# Altium project Buck_24_to_5_Eval.PrjPcb
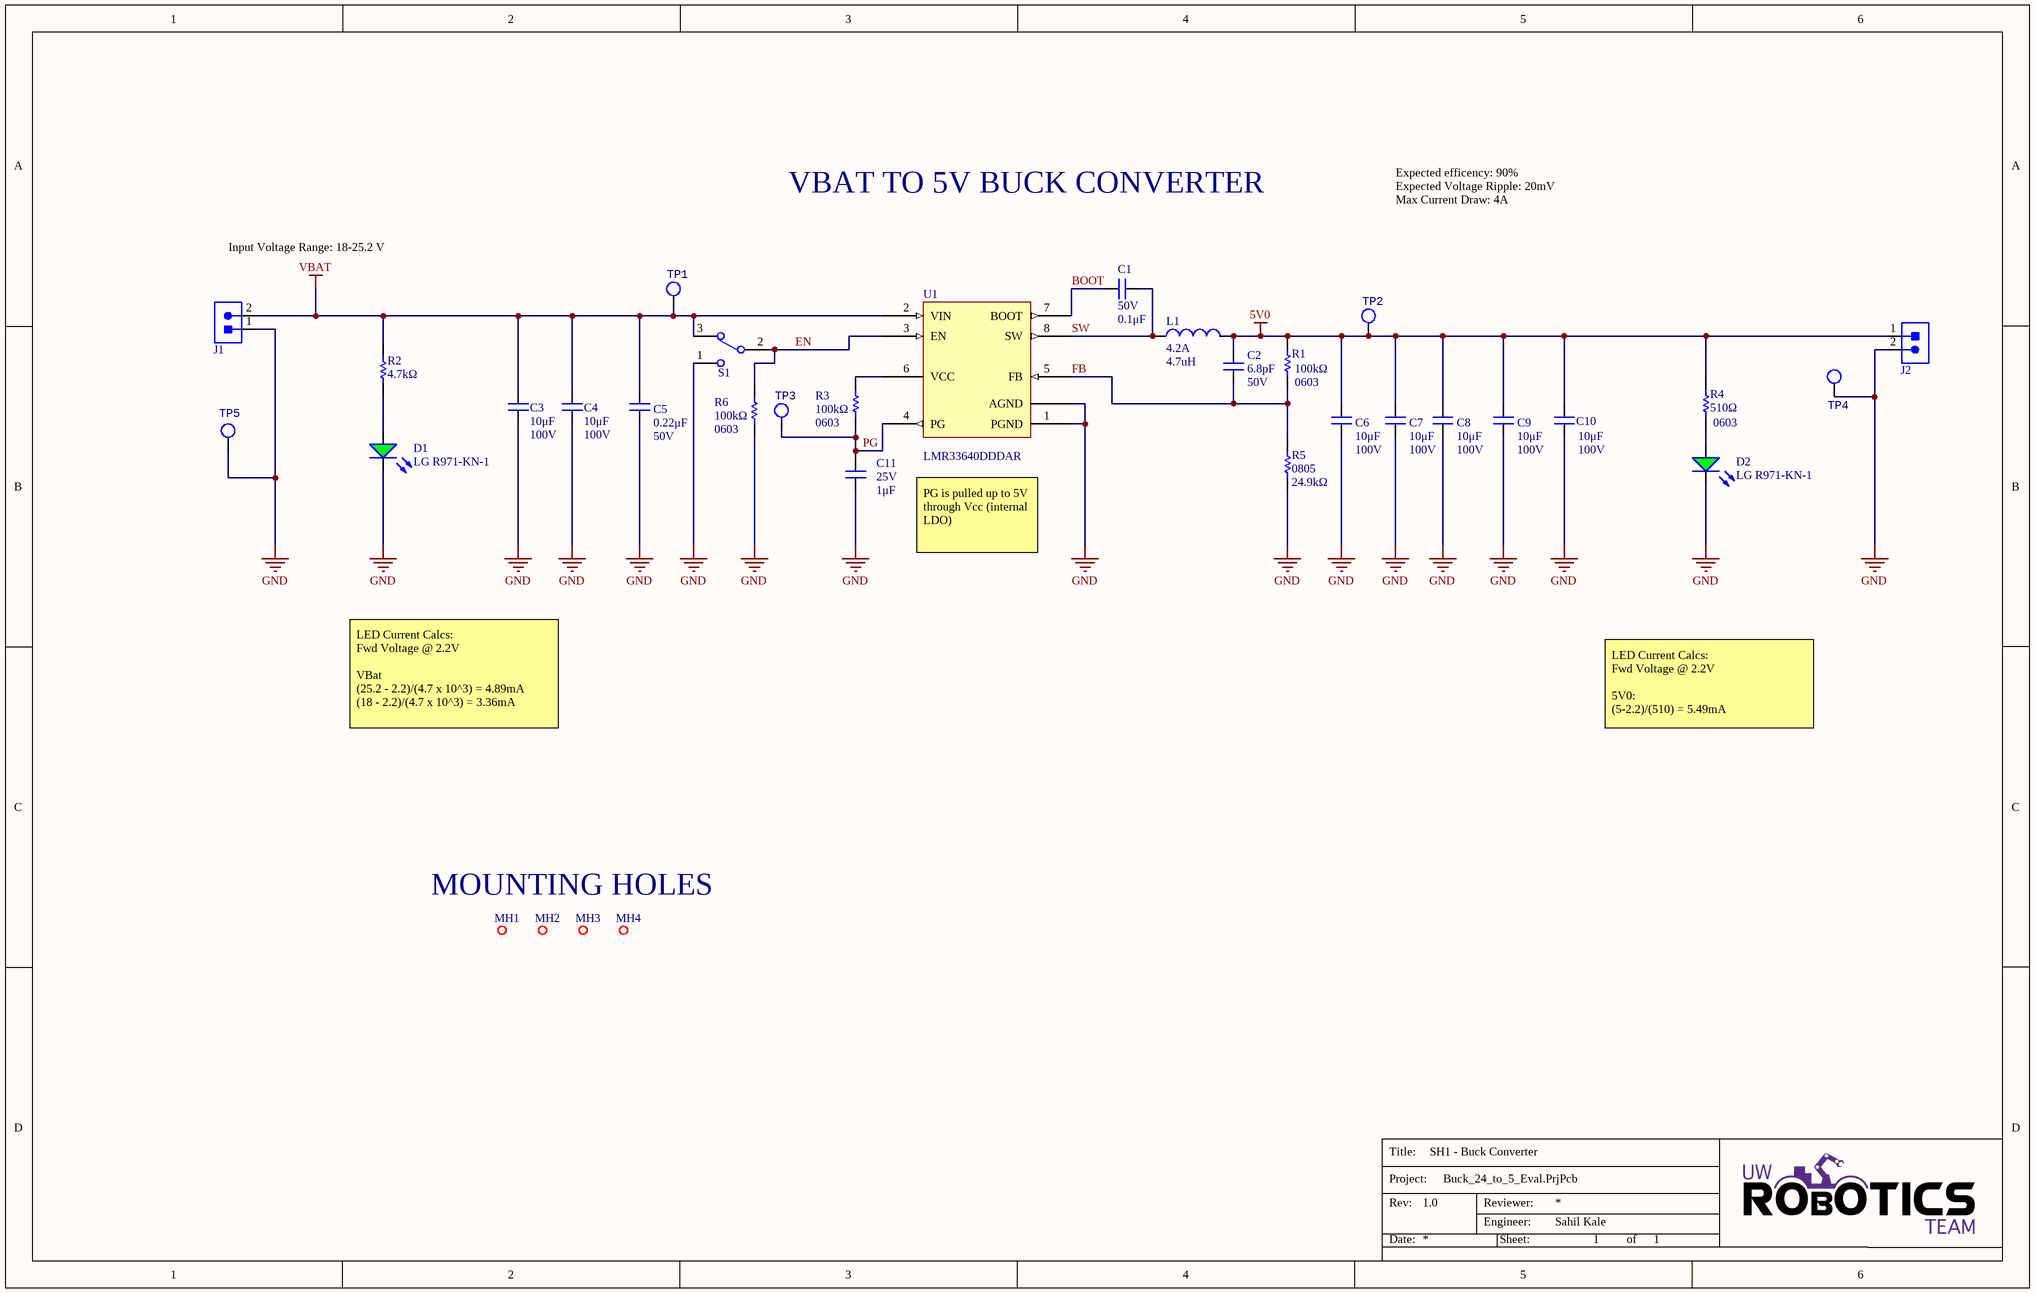
[diagram p0: SH1 - Buck Converter.SchDoc]
1 sheet, 33 parts. Net scope: global (net labels, ports and power ports of the same name join across sheets).
Board file: Buck_Eval_Board.PcbDoc

## Sheet SH1 - Buck Converter.SchDoc: SH1 - Buck Converter
size B; Date: 3/9/2021; Author: Sahil Kale; Engineer: Sahil Kale; Revision: 1.0; SheetNumber: 1; SheetTotal: 1; Time: 00:11

### Parts
C1  value 0.1μF  Voltage Rating: 50V  [CAP0603]  (hidden comment: CAP_0.1uF_50V_0603)
C2  value 6.8pF  Voltage Rating: 50V  [CAP0603]  (hidden comment: CAP_6.8pF_50V_0603)
C3  value 10μF  Voltage Rating: 100V  [CAP1210]  (hidden comment: CAP_10uF_100V_1210)
C4  value 10μF  Voltage Rating: 100V  [CAP1210]  (hidden comment: CAP_10uF_100V_1210)
C5  value 0.22μF  Voltage Rating: 50V  [CAP2012]  (hidden comment: CAP_0.22uF_50V_0805)
C6  value 10μF  Voltage Rating: 100V  [CAP1210]  (hidden comment: CAP_10uF_100V_1210)
C7  value 10μF  Voltage Rating: 100V  [CAP1210]  (hidden comment: CAP_10uF_100V_1210)
C8  value 10μF  Voltage Rating: 100V  [CAP1210]  (hidden comment: CAP_10uF_100V_1210)
C9  value 10μF  Voltage Rating: 100V  [CAP1210]  (hidden comment: CAP_10uF_100V_1210)
C10  value 10μF  Voltage Rating: 100V  [CAP1210]  (hidden comment: CAP_10uF_100V_1210)
C11  value 1μF  Voltage Rating: 25V  [CAP0603]  (hidden comment: CAP_1uF_25V_0603)
D1  Manufacturer Part Number 1: LG R971-KN-1  [LED_0805_GREEN]  (hidden comment: LED_GREEN)
D2  Manufacturer Part Number 1: LG R971-KN-1  [LED_0805_GREEN]  (hidden comment: LED_GREEN)
J1  CON_2POS_SCREW_TERM  [1935161]  (value not drawn)
J2  CON_2POS_SCREW_TERM  [1935161]  (value not drawn)
L1  Rated Current-Max: 4.2A  Inductance-Nom (L): 4.7uH  [VLS6045EX-4R7M]  (hidden comment: IND_4.7uH_4.2A)
MH1  MOUNTING_HOLE_M3  [MOUNTING_HOLE_3mm]  (value not drawn)  (no BOM)
MH2  MOUNTING_HOLE_M3  [MOUNTING_HOLE_3mm]  (value not drawn)  (no BOM)
MH3  MOUNTING_HOLE_M3  [MOUNTING_HOLE_3mm]  (value not drawn)  (no BOM)
MH4  MOUNTING_HOLE_M3  [MOUNTING_HOLE_3mm]  (value not drawn)  (no BOM)
R1  value 100kΩ  Package/Footprint: 0603  [RESC0603]  (hidden comment: RES_100kΩ_0603_1%)
R2  value 4.7kΩ  [RESC0603]  (hidden comment: RES_4.7kΩ_0603)
R3  value 100kΩ  Package/Footprint: 0603  [RESC0603]  (hidden comment: RES_100kΩ_0603_1%)
R4  value 510Ω  Package: 0603  [RESC0603]  (hidden comment: RES_510Ω_0603)
R5  value 24.9kΩ  Package/Footprint: 0805  [RESC0805]  (hidden comment: RES_24.9kΩ_0805_1%_1)
R6  value 100kΩ  Package/Footprint: 0603  [RESC0603]  (hidden comment: RES_100kΩ_0603_1%)
S1  SW_TOGGLE_SPDT  [100SP1T1B4M2QE]  (value not drawn)
TP1  TESTPOINT_LOOP  [TESTPOINT_LOOP]  (value not drawn)
TP2  TESTPOINT_LOOP  [TESTPOINT_LOOP]  (value not drawn)
TP3  TESTPOINT_LOOP  [TESTPOINT_LOOP]  (value not drawn)
TP4  TESTPOINT_LOOP  [TESTPOINT_LOOP]  (value not drawn)
TP5  TESTPOINT_LOOP  [TESTPOINT_LOOP]  (value not drawn)
U1  Manufacturer Part Number 1: LMR33640DDDAR  [8-SO PowerPad]  (hidden comment: BUCK_LMR33640DDDAR)

### Nets
5V0: C2.2 C6.2 C7.2 C8.2 C9.2 C10.2 J2.1 L1.2 R1.2 R4.1 TP2.1
GND: C3.1 C4.1 C5.1 C6.1 C7.1 C8.1 C9.1 C10.1 C11.1 D1.2(K) D2.2(K) J1.1 J2.2 R5.1 R6.1 S1.1 TP4.1 TP5.1 U1.1(PGND) U1.9(AGND)
VBAT: C3.2 C4.2 C5.2 J1.2 R2.2 S1.3 TP1.1 U1.2(VIN)
BOOT: C1.1 U1.7(BOOT)
EN: R6.2 S1.2 U1.3(EN)
FB: C2.1 R1.1 R5.2 U1.5(FB)
PG: C11.2 R3.1 TP3.1 U1.4(PG)
SW: C1.2 L1.1 U1.8(SW)
NetD1_1: D1.1(A) R2.1
NetD2_1: D2.1(A) R4.2
NetR3_2: R3.2 U1.6(VCC)

### Notes on the sheet
- VBAT TO 5V BUCK CONVERTER
- Expected efficency: 90%
- Expected Voltage Ripple: 20mV
- Max Current Draw: 4A
- Input Voltage Range: 18-25.2 V
- PG is pulled up to 5V through Vcc (internal LDO)
- LED Current Calcs:
  Fwd Voltage @ 2.2V
  VBat
  (25.2 - 2.2)/(4.7 x 10^3) = 4.89mA
  (18 - 2.2)/(4.7 x 10^3) = 3.36mA
- LED Current Calcs:
  Fwd Voltage @ 2.2V
  5V0:
  (5-2.2)/(510) = 5.49mA
- MOUNTING HOLES
- Title:
- Project:
- Date:
- Rev:
- Reviewer:
- Engineer:
- Sheet:
- of

### Library data of the parts
C1 = CAP_0.1uF_50V_0603: CAP CER 0.1UF 50V X7R 0603; Manufacturer Part Number 1: CC0603KRX7R9BB104; Manufacturer 1: Yageo; Package/Footprint: 0603; Supplier Part Number 1: 311-1344-1-ND; Supplier 1: Digi-Key; Mounting Type: SMD; Dielectric: X7R
C2 = CAP_6.8pF_50V_0603: CAP CER 6.8PF 50V; Manufacturer 1: Yageo; Manufacturer Part Number 1: CGA3E2C0G1H6R8D080AD; Package/Footprint: 0603; Dielectric: C0G; Mounting Type: SMD; Supplier Part Number 21: 445-9798-1-ND; Supplier 1: Digi-Key; Supplier Part Number 1: 445-9798-1-ND
C3 C4 = CAP_10uF_100V_1210: CAP CER 10uF 100V X7S 10% 1210; Manufacturer 1: Murata; Manufacturer Part Number 1: GRM32EC72A106KE05L; Package/Footprint: 1210; Supplier 1: Digi-Key; Mounting Type: SMD; Supplier Part Number 1: 490-16266-1-ND; Dielectric: X7S
C5 = CAP_0.22uF_50V_0805: CAP CER 0.22UF 50V X7R 0805; Manufacturer Part Number 1: C0805C224K5RACTU; Manufacturer 1: KEMET; Package/Footprint: 0805; Supplier Part Number 1: 399-3491-1-ND; Supplier 1: Digi-Key; Mounting Type: SMD; Dielectric: X7R; LCSC Part #: C5378
C6-C10 = CAP_10uF_100V_1210: CAP CER 10uF 100V X7S 10% 1210; Manufacturer Part Number 1: GRM32EC72A106KE05L; Manufacturer 1: Murata; Package/Footprint: 1210; Supplier Part Number 1: 490-16266-1-ND; Supplier 1: Digi-Key; Dielectric: X7S; Mounting Type: SMD
C11 = CAP_1uF_25V_0603: CAP CER 1UF 25V X5R 0603; Manufacturer 1: Samsung; Manufacturer Part Number 1: CL10A105KA8NNNC; Package/Footprint: 0603; Supplier 1: Digi-Key; Mounting Type: SMD; Supplier Part Number 1: 1276-1102-1-ND; Dielectric: X5R
D1 D2 = LED_GREEN: LED GREEN DIFFUSED 0805 SMD; Manufacturer 1: OSRAM; Forward Voltage Drop: 2.2V; Package/Footprint: 0805; Supplier Part Number 1: 475-1410-1-ND; Supplier 1: Digi-Key; Mounting Type: SMD
J1 J2 = CON_2POS_SCREW_TERM: TERM BLK 2POS SIDE ENTRY 5MM; Manufacturer 1: Phoenix Contact; Package/Footprint: SMD; Supplier 1: Digi-Key; Mounting Type: TH; Supplier Part Number 1: 277-1667-ND; Manufacturer Part Number 1: 1935161
L1 = IND_4.7uH_4.2A: FIXED IND 4.7UH 4.2A 35MOHM SMD; Manufacturer: TDK; Core Material: Ferrite; Tolerance: 20%; Case/Size Code: 2424; DC Resistance (DCR): 27mR; Inductor Application: POWER INDUCTOR; Inductor Type: GENERAL PURPOSE INDUCTOR; Number of Functions: 1; Shape/Size Description: RECTANGULAR PACKAGE; Shielding: Shielded; Test Frequency: 100kHz; Package Height: 4.5mm; Package Length: 6mm; Supplier 1: Digi-Key; RoHS: Yes; Category: Fixed Inductors; Stock 1: 9330; Pricing 1: 1=0.46000, 10=0.40200, 25=0.37360, 50=0.31620, 100=0.28750, 250=0.27024, 500=0.24150 (USD); Number of Pins: 2; Min Operating Temperature: -40°C; Max Operating Temperature: 105°C; Construction: Rectangular; Package Style: SMTMeter; Packaging: Cut Tape; Surface Mount: Yes; Terminal Placement: Dual Ended; Termination: One Surface; Package Width: 6mm; REACH SVHC: Yes; RoHS Compliant: Yes; ComponentLink1URL: https://datasheet.ciiva.com:443/pdfs/VipMasterIC/IC/TDKC/TDKC-S-A0006138306/TDKC-S-A0006138306-1.pdf?src-supplier=IHS+Markit; ComponentLink1Description: https://datasheet.ciiva.com:443/pdfs/VipMasterIC/IC/TDKC/TDKC-S-A0006138306/TDKC-S-A0006138306-1.pdf?src-supplier=IHS+Markit; ComponentLink2URL: http://www.farnell.com/datasheets/2724083.pdf?src-supplier=Farnell; ComponentLink2Description: http://www.farnell.com/datasheets/2724083.pdf?src-supplier=Farnell; ComponentLink3URL: https://media.digikey.com/pdf/Data%20Sheets/TDK%20PDFs/VLS-EX_Series_Br.pdf?src-supplier=Digi-Key; ComponentLink3Description: https://media.digikey.com/pdf/Data%20Sheets/TDK%20PDFs/VLS-EX_Series_Br.pdf?src-supplier=Digi-Key; ComponentLink4URL: http://www.farnell.com/datasheets/2724083.pdf?src-supplier=Newark; ComponentLink4Description: http://www.farnell.com/datasheets/2724083.pdf?src-supplier=Newark; ComponentLink5URL: https://product.tdk.com/info/en/catalog/datasheets/inductor_commercial_power_vls6045ex_en.pdf?src-supplier=Digi-Key; ComponentLink5Description: https://product.tdk.com/info/en/catalog/datasheets/inductor_commercial_power_vls6045ex_en.pdf?src-supplier=Digi-Key; ComponentLink6URL: http://www.farnell.com/datasheets/2724083.pdf?src-supplier=Element14; ComponentLink6Description: http://www.farnell.com/datasheets/2724083.pdf?src-supplier=Element14; Supplier Part Number 1: 445-173055-1-ND; Manufacturer Part Number 1: VLS6045EX-4R7M; Verified: No; Mounting Type: Surface
R1 R3 R6 = RES_100kΩ_0603_1%: RES 100K OHM 1% 1/10W 0603; Manufacturer 1: Yageo; Manufacturer Part Number 1: RC0603FR-07100KL; Supplier Part Number 1: 311-100KHRCT-ND; Supplier 1: Digi-Key; Mounting Type: SMD
R2 = RES_4.7kΩ_0603_5%: RES 4.7K OHM 5% 1/10W 0603; Manufacturer 1: Yageo; Manufacturer Part Number 1: RC0603JR-074K7L; Supplier Part Number 1: 311-4.7KGRCT-ND; Supplier 1: Digi-Key
R4 = RES_510Ω_0603_5%: RES 510 OHM 5% 1/10W 0603; Manufacturer 1: Vishay Dale; Manufacturer Part Number 1: CRCW0603510RJNEA; Supplier Part Number 1: 541-510GCT-ND; Supplier 1: Digi-Key
R5 = RES_24.9kΩ_0805_1%_1: RES 24.9K OHM 1% 1/8W 0805; Manufacturer 1: Stackpole Electronics Inc; Manufacturer Part Number 1: RMCF0805FT24K9CT-ND; Supplier 1: Digi-Key; Mounting Type: SMD; Supplier Part Number 1: RMCF0805FT24K9
S1 = SW_TOGGLE_SPDT: SWITCH TOGGLE SPDT 5A 120V; Manufacturer 1: E-Switch; Voltage Rating (DC): 28V; Package/Footprint: TH; Supplier 1: Digi-Key; Mounting Type: TH; Throw Configuration: SPDT; Supplier Part Number 1: EG2355-ND; Manufacturer Part Number 1: 100SP1T1B4M2QE
TP1-TP5 = TESTPOINT_LOOP: TESTPOINT THRUHOLE; Manufacturer 1: Keystone Electronics; Manufacturer Part Number 1: 5002; Package/Footprint: TH; Supplier Part Number 1: 36-5002-ND; Supplier 1: Digi-Key; Mounting Type: TH
U1 = BUCK_LMR33640DDDAR: IC REG BUCK ADJUSTABLE 4A 8SOPWR; Manufacturer: Texas Instruments; Voltage - Input Max: 36 V; Voltage - Input Min: 3.8 V; Switching Frequency: 1 MHz; Supplier 1: Digi-Key; RoHS: No; Category: Voltage Regulators - Switching; Stock 1: 3018; Pricing 1: 1=2.66000, 10=2.38800, 25=2.25240, 100=1.80200, 250=1.57676, 500=1.53170, 1000=1.21635 (USD); ComponentLink1URL: https://www.ti.com:443/lit/ds/symlink/lmr33640.pdf?src-supplier=IHS+Markit; ComponentLink1Description: https://www.ti.com:443/lit/ds/symlink/lmr33640.pdf?src-supplier=IHS+Markit; Supplier Part Number 1: 296-LMR33640DDDARCT-ND; Current Output: 4A; Verified: No